# Altium project protoboard.PrjPcb
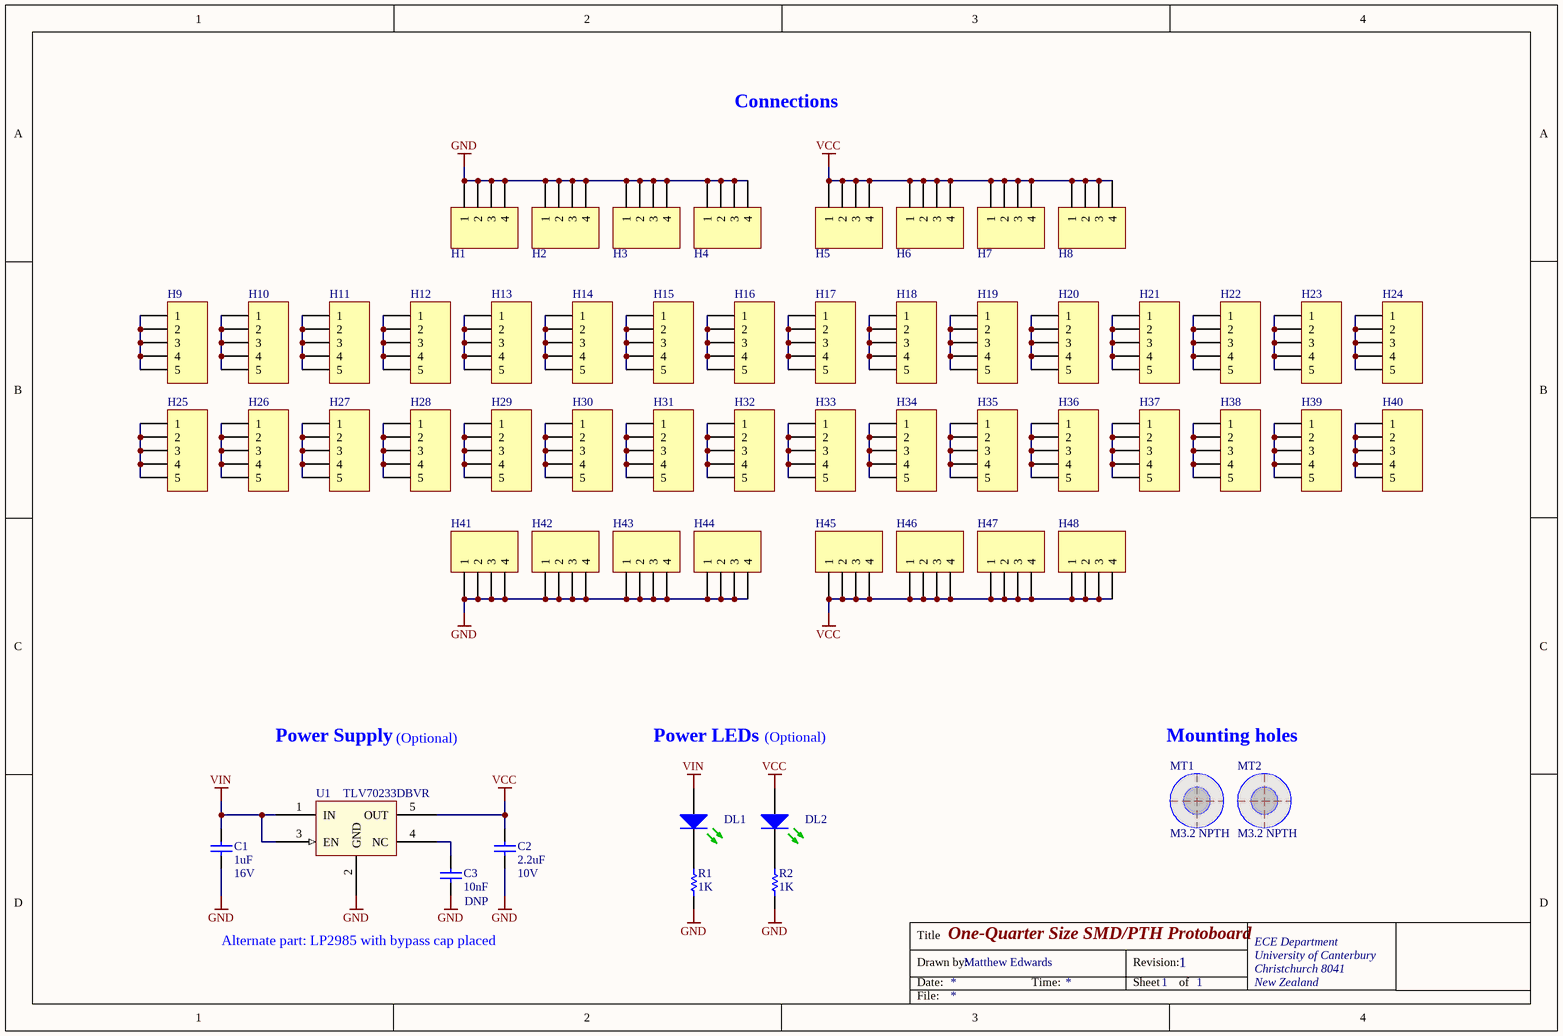
[diagram p0: protoboard.SchDoc]
1 sheet, 58 parts. Net scope: global (net labels, ports and power ports of the same name join across sheets).
Board file: protoboard.PcbDoc

## Sheet protoboard.SchDoc: One-Quarter Size SMD/PTH Protoboard
size A4; DrawnBy: Matthew Edwards; Address1: ECE Department; Address2: University of Canterbury; Address3: Christchurch 8041; Address4: New Zealand; Revision: 1; SheetNumber: 1; SheetTotal: 1

### Parts
C1  Max Voltage: 16V  [CAPC1608L]  (hidden comment: 1uF)
C2  Max Voltage: 10V  [CAPC1608L]  (hidden comment: 2.2uF)
C3  DNP  value 10nF  [CAPC1608L]
DL1  Dark Green  [WL-SMCW0603]  (value not drawn)
DL2  Dark Green  [WL-SMCW0603]  (value not drawn)
H1  CONN_04  [1X04 hex]  (value not drawn)
H2  CONN_04  [1X04 hex]  (value not drawn)
H3  CONN_04  [1X04 hex]  (value not drawn)
H4  CONN_04  [1X04 hex]  (value not drawn)
H5  CONN_04  [1X04 hex]  (value not drawn)
H6  CONN_04  [1X04 hex]  (value not drawn)
H7  CONN_04  [1X04 hex]  (value not drawn)
H8  CONN_04  [1X04 hex]  (value not drawn)
H9  CONN_05  [1X05 square]  (value not drawn)
H10  CONN_05  [1X05 square]  (value not drawn)
H11  CONN_05  [1X05 square]  (value not drawn)
H12  CONN_05  [1X05 square]  (value not drawn)
H13  CONN_05  [1X05 square]  (value not drawn)
H14  CONN_05  [1X05 square]  (value not drawn)
H15  CONN_05  [1X05 square]  (value not drawn)
H16  CONN_05  [1X05 square]  (value not drawn)
H17  CONN_05  [1X05 square]  (value not drawn)
H18  CONN_05  [1X05 square]  (value not drawn)
H19  CONN_05  [1X05 square]  (value not drawn)
H20  CONN_05  [1X05 square]  (value not drawn)
H21  CONN_05  [1X05 square]  (value not drawn)
H22  CONN_05  [1X05 square]  (value not drawn)
H23  CONN_05  [1X05 square]  (value not drawn)
H24  CONN_05  [1X05 square]  (value not drawn)
H25  CONN_05  [1X05 square]  (value not drawn)
H26  CONN_05  [1X05 square]  (value not drawn)
H27  CONN_05  [1X05 square]  (value not drawn)
H28  CONN_05  [1X05 square]  (value not drawn)
H29  CONN_05  [1X05 square]  (value not drawn)
H30  CONN_05  [1X05 square]  (value not drawn)
H31  CONN_05  [1X05 square]  (value not drawn)
H32  CONN_05  [1X05 square]  (value not drawn)
H33  CONN_05  [1X05 square]  (value not drawn)
H34  CONN_05  [1X05 square]  (value not drawn)
H35  CONN_05  [1X05 square]  (value not drawn)
H36  CONN_05  [1X05 square]  (value not drawn)
H37  CONN_05  [1X05 square]  (value not drawn)
H38  CONN_05  [1X05 square]  (value not drawn)
H39  CONN_05  [1X05 square]  (value not drawn)
H40  CONN_05  [1X05 square]  (value not drawn)
H41  CONN_04  [1X04 hex]  (value not drawn)
H42  CONN_04  [1X04 hex]  (value not drawn)
H43  CONN_04  [1X04 hex]  (value not drawn)
H44  CONN_04  [1X04 hex]  (value not drawn)
H45  CONN_04  [1X04 hex]  (value not drawn)
H46  CONN_04  [1X04 hex]  (value not drawn)
H47  CONN_04  [1X04 hex]  (value not drawn)
H48  CONN_04  [1X04 hex]  (value not drawn)
MT1  M3.2 NPTH  [MNT-HOLE_3.2mm_NPTH]  (no BOM)
MT2  M3.2 NPTH  [MNT-HOLE_3.2mm_NPTH]  (no BOM)
R1  1K  [RESC1608L]
R2  1K  [RESC1608L]
U1  TLV70233DBVR  [SOT95P280X145-5N]

### Nets
GND: C1.1 C2.1 C3.2 H1.1 H1.2 H1.3 H1.4 H2.1 H2.2 H2.3 H2.4 H3.1 H3.2 H3.3 H3.4 H4.1 H4.2 H4.3 H4.4 H41.1 H41.2 H41.3 H41.4 H42.1 H42.2 H42.3 H42.4 H43.1 H43.2 H43.3 H43.4 H44.1 H44.2 H44.3 H44.4 R1.1 R2.1 U1.2(GND)
VCC: C2.2 DL2.2(A) H5.1 H5.2 H5.3 H5.4 H6.1 H6.2 H6.3 H6.4 H7.1 H7.2 H7.3 H7.4 H8.1 H8.2 H8.3 H8.4 H45.1 H45.2 H45.3 H45.4 H46.1 H46.2 H46.3 H46.4 H47.1 H47.2 H47.3 H47.4 H48.1 H48.2 H48.3 H48.4 U1.5(OUT)
VIN: C1.2 DL1.2(A) U1.1(IN) U1.3(EN)
NetC3_1: C3.1 U1.4(NC)
NetDL1_1: DL1.1(K) R1.2
NetDL2_1: DL2.1(K) R2.2
NetH9_1: H9.1 H9.2 H9.3 H9.4 H9.5
NetH10_1: H10.1 H10.2 H10.3 H10.4 H10.5
NetH11_1: H11.1 H11.2 H11.3 H11.4 H11.5
NetH12_1: H12.1 H12.2 H12.3 H12.4 H12.5
NetH13_1: H13.1 H13.2 H13.3 H13.4 H13.5
NetH14_1: H14.1 H14.2 H14.3 H14.4 H14.5
NetH15_1: H15.1 H15.2 H15.3 H15.4 H15.5
NetH16_1: H16.1 H16.2 H16.3 H16.4 H16.5
NetH17_1: H17.1 H17.2 H17.3 H17.4 H17.5
NetH18_1: H18.1 H18.2 H18.3 H18.4 H18.5
NetH19_1: H19.1 H19.2 H19.3 H19.4 H19.5
NetH20_1: H20.1 H20.2 H20.3 H20.4 H20.5
NetH21_1: H21.1 H21.2 H21.3 H21.4 H21.5
NetH22_1: H22.1 H22.2 H22.3 H22.4 H22.5
NetH23_1: H23.1 H23.2 H23.3 H23.4 H23.5
NetH24_1: H24.1 H24.2 H24.3 H24.4 H24.5
NetH25_1: H25.1 H25.2 H25.3 H25.4 H25.5
NetH26_1: H26.1 H26.2 H26.3 H26.4 H26.5
NetH27_1: H27.1 H27.2 H27.3 H27.4 H27.5
NetH28_1: H28.1 H28.2 H28.3 H28.4 H28.5
NetH29_1: H29.1 H29.2 H29.3 H29.4 H29.5
NetH30_1: H30.1 H30.2 H30.3 H30.4 H30.5
NetH31_1: H31.1 H31.2 H31.3 H31.4 H31.5
NetH32_1: H32.1 H32.2 H32.3 H32.4 H32.5
NetH33_1: H33.1 H33.2 H33.3 H33.4 H33.5
NetH34_1: H34.1 H34.2 H34.3 H34.4 H34.5
NetH35_1: H35.1 H35.2 H35.3 H35.4 H35.5
NetH36_1: H36.1 H36.2 H36.3 H36.4 H36.5
NetH37_1: H37.1 H37.2 H37.3 H37.4 H37.5
NetH38_1: H38.1 H38.2 H38.3 H38.4 H38.5
NetH39_1: H39.1 H39.2 H39.3 H39.4 H39.5
NetH40_1: H40.1 H40.2 H40.3 H40.4 H40.5

### Notes on the sheet
- Connections
- Power Supply
- (Optional)
- Power LEDs
- Mounting holes
- Alternate part: LP2985 with bypass cap placed
- Title
- Drawn by:
- Date:
- Time:
- Revision:
- Sheet
- of
- File:

### Library data of the parts
C1 = CC_1uF_0603: CAP CER 1uF Y5V -20% +80% 16V 0603; PackageReference: 0603; Code_IPC: 1608 [0603]; Verify: *; Supplier: ECE Dept; Storage Location: PCB Assembly WS; Value: 1uF
C2 = CC_2.2uF_0603: CAP CER 2.2uF X5R +-20% 10V 0603; PackageReference: 0603; Code_IPC: 1608 [0603]; Verify: *; Supplier: ECE Dept; Storage Location: PCB Assembly WS; Value: 2.2uF
C3 = CC_10nF_0603: CAP CER 10nF X7R +-10% 50V 0603; PackageReference: 0603; Code_IPC: 1608 [0603]; Verify: *; Supplier: ECE Dept; Storage Location: PCB Assembly WS
DL1 DL2 = DL_150060GS75000: LED Dk Green 430mcd 0603 SMD; Manufacturer: WURTH ELEKTRONIK; Forward Current If: 30; Wavelength Typ: 520; Forward Voltage: 3.2; Lens Shape: Rectangular; Luminous Intensity: 430; Viewing Angle: 140°; LED Mounting: SMD; Supplier 1: Farnell; Supplier Part Number 1: 2322070; Manufacturer Part Number: 150060GS75000; Storage Location: PCB Assembly WS; Supplier: ECE Dept; LED Colour: Dark Green
H1-H8 H41-H48 = CONN_04: CONN HEADER 4POS 2.54mm VERT_Thru Hole
H9-H40 = CONN_05: CONN HEADER 5POS 2.54mm VERT_Thru Hole
MT1 MT2 = MC_M3.2_HOLE: Fixing M3.2 Mount Hole NPTH; Manufacturer: Hi-Q; Manufacturer PN: 3BV series M3 Clearance; price: 0; Supplier: ECE Dept; value: M3.2 NPTH
R1 R2 = RS_1K: RES 1.0K OHM 1/10W 5% 0603 SMD; Storage Location: PCB Assembly WS; Supplier: ECE Dept; Value: 1K
U1 = SV_TLV70233DBVR: IC REG LDO 3.3V 0.3A SOT23-5; Manufacturer: Texas Instruments; Current - Output: 300mA; Supplier 1: Digi-Key; Operating Temperature: -40°C ~ 125°C; Package / Case: SC-74A, SOT-753; Pricing: 1=0.77, 10=0.647, 25=0.5672, 100=0.4853, 250=0.421, 500=0.35658, 750=0.30789, 1000=0.2749 (NZD); Supplier Part Number 1: 296-32415-1-ND; Manufacturer Part Number: TLV70233DBVR